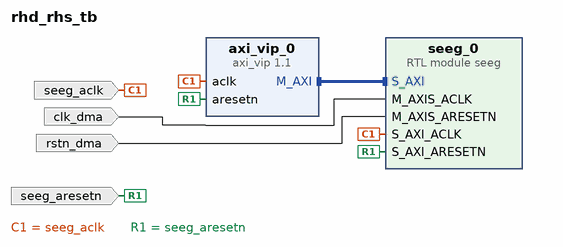
[diagram p0: block diagram of the top level]
# Vivado block design rhd_rhs_tb, xck26-sfvc784-2LV-c, Vivado 2023.1
create_bd_design rhd_rhs_tb

create_bd_port -dir I -type clk seeg_aclk
set_property -dict {CONFIG.ASSOCIATED_RESET seeg_aresetn CONFIG.FREQ_HZ 100000000} [get_bd_ports seeg_aclk]
create_bd_port -dir I clk_dma
create_bd_port -dir I -type rst seeg_aresetn
create_bd_port -dir I -type rst rstn_dma

create_bd_cell -type ip -vlnv xilinx.com:ip:axi_vip:1.1 axi_vip_0
set_property -dict [list \
  CONFIG.ADDR_WIDTH 32 \
  CONFIG.DATA_WIDTH 32 \
  CONFIG.HAS_BRESP 1 \
  CONFIG.HAS_PROT 1 \
  CONFIG.HAS_RRESP 1 \
  CONFIG.HAS_WSTRB 1 \
  CONFIG.INTERFACE_MODE MASTER \
  CONFIG.PROTOCOL AXI4LITE \
  CONFIG.READ_WRITE_MODE READ_WRITE \
] [get_bd_cells axi_vip_0]
create_bd_cell -type module -reference seeg seeg_0

# ---- connections ----

connect_bd_intf_net [get_bd_intf_pins axi_vip_0/M_AXI] [get_bd_intf_pins seeg_0/S_AXI]
connect_bd_net [get_bd_ports clk_dma] [get_bd_pins seeg_0/M_AXIS_ACLK]
connect_bd_net -net rhd_aclk_1 [get_bd_ports seeg_aclk] [get_bd_pins axi_vip_0/aclk] [get_bd_pins seeg_0/S_AXI_ACLK]
connect_bd_net -net rhd_aresetn_1 [get_bd_ports seeg_aresetn] [get_bd_pins axi_vip_0/aresetn] [get_bd_pins seeg_0/S_AXI_ARESETN]
connect_bd_net [get_bd_ports rstn_dma] [get_bd_pins seeg_0/M_AXIS_ARESETN]

validate_bd_design
save_bd_design
